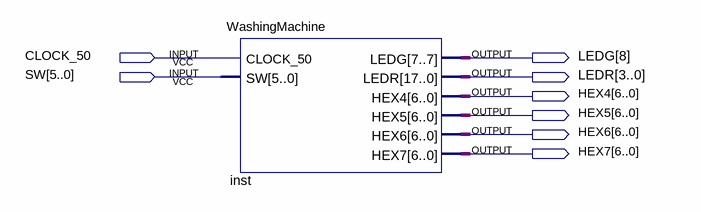
[diagram p0: schematic sheet]
// Quartus schematic WashingMachine_MainBlock.bdf as structural Verilog: 1 symbols, 8 pins
module WashingMachine_MainBlock (
  input  CLOCK_50,
  input  [5:0] SW,
  output [8:8] LEDG,
  output [3:0] LEDR,
  output [6:0] HEX4,
  output [6:0] HEX5,
  output [6:0] HEX6,
  output [6:0] HEX7
);

  WashingMachine inst (
    .CLOCK_50(CLOCK_50), .SW(SW), .LEDG(LEDG[8]), .LEDR(LEDR), .HEX4(HEX4), .HEX5(HEX5), .HEX6(HEX6),
    .HEX7(HEX7));
endmodule
